# Altium schematic sheet Sheet1.SchDoc
size A4; SheetNumber: 12; SheetTotal: 14
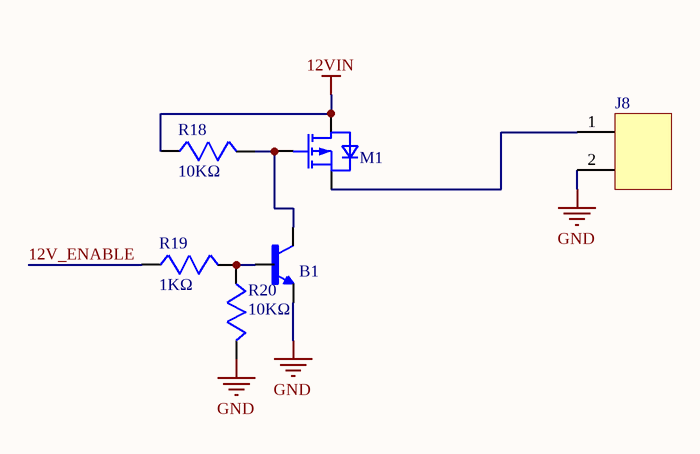
[diagram p0: Sheet1.SchDoc]

## Parts
B1  MMBT3904  [MMBT3904 RFG]  (value not drawn)
J8  2 POS  [0901362102]  (value not drawn)
M1  mosfet  [IRLML6402]  (value not drawn)
R18  value 10KΩ  [402 RESISTOR]  (hidden comment: 0402. RESİSTOR)
R19  value 1KΩ  [402 RESISTOR]  (hidden comment: 0402. RESİSTOR)
R20  value 10KΩ  [402 RESISTOR]  (hidden comment: 0402. RESİSTOR)

## Nets
12VIN: M1.3(DRAIN) R18.1
GND: B1.2(E) J8.2 R20.2
12V_ENABLE: R19.1
NetB1_1: B1.1(B) R19.2 R20.1
NetB1_3: B1.3(C) M1.1(GATE) R18.2
NetJ8_1: J8.1 M1.2(SOURCE)

## Library data of the parts
B1 = MMBT3904: TRANS NPN 40V 0.2A SOT23-3; MPN: MMBT3904
J8 = 0901362102: CONN HEADER R/A 2POS 2.54MM; MPN: 0901362102
M1 = IRLML6402: MOSFET N-CH 12V 2.1A 3PICOSTAR; MPN: IRLML6402
R18 R20 = RES SMD 0402: MPN: RNCF0402BTE10K0; Package: 0402
R19 = RES SMD 0402: MPN: CR0402FC1KS001; Package: 0402